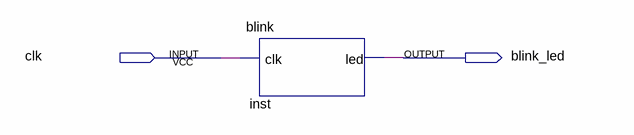
[diagram p0: schematic sheet]
// Quartus schematic bs.bdf as structural Verilog: 1 symbols, 2 pins
module bs (
  input  clk,
  output blink_led
);

  blink inst (.clk(clk), .led(blink_led));
endmodule
